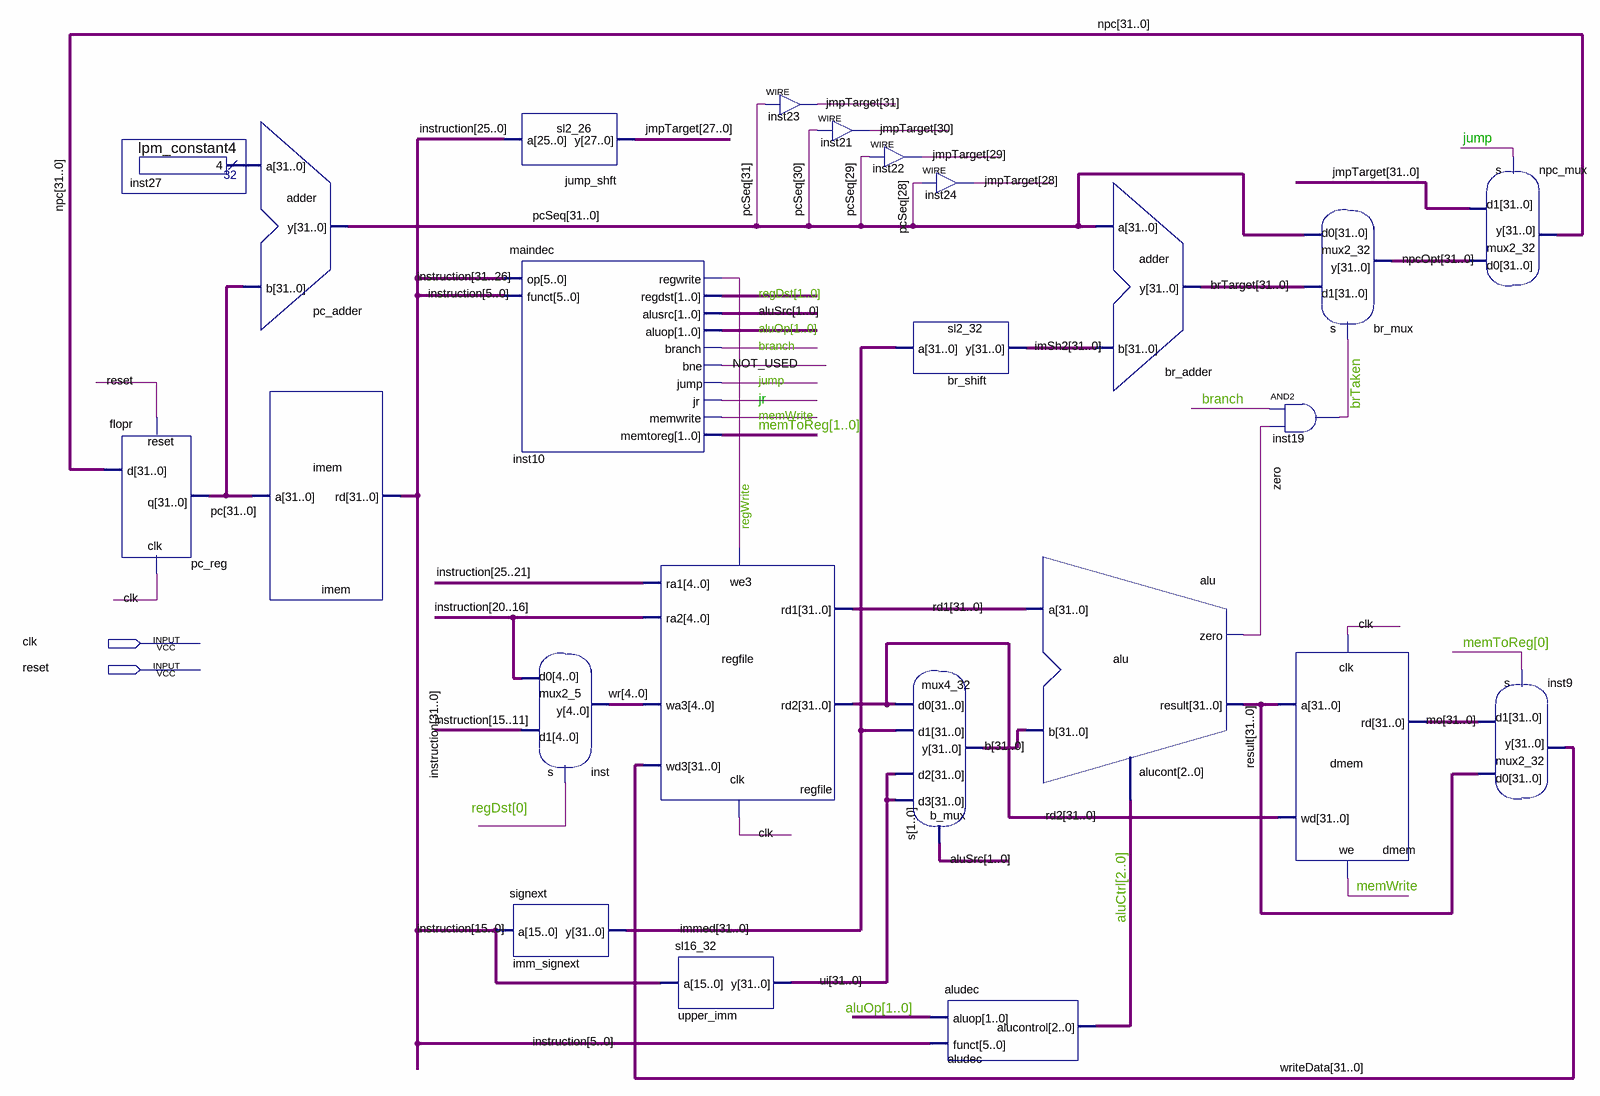
[diagram p0: schematic sheet]
// Quartus schematic mips.bdf as structural Verilog: 24 symbols, 2 pins
module mips (
  input  clk,
  input  reset
);

  wire branch, brTaken, jr, jump, memWrite, NOT_USED, regWrite, zero;
  wire [1:0] aluOp, aluSrc, memToReg, regDst;
  wire [2:0] aluCtrl;
  wire [4:0] wr;
  wire [31:0] b, brTarget, immed, imSh2, inst27_result, instruction, jmpTarget, mo, npc, npcOpt, pc, pcSeq,
       rd1, rd2, result, ui, writeData;

  lpm_constant4 inst27 (.result(inst27_result));
  flopr pc_reg (.clk(clk), .reset(reset), .d(npc), .q(pc));
  adder pc_adder (.a(inst27_result), .b(pc), .y(pcSeq));
  imem imem (.a(pc), .rd(instruction));
  sl2_26 jump_shft (.a(instruction[25:0]), .y(jmpTarget[27:0]));
  maindec inst10 (
    .op(instruction[31:26]), .funct(instruction[5:0]), .regwrite(regWrite), .regdst(regDst), .alusrc(aluSrc),
    .aluop(aluOp), .branch(branch), .bne(NOT_USED), .jump(jump), .jr(jr), .memwrite(memWrite),
    .memtoreg(memToReg));
  signext imm_signext (.a(instruction[15:0]), .y(immed));
  mux2_5 inst (.d0(instruction[20:16]), .d1(instruction[15:11]), .s(regDst[0]), .y(wr));
  regfile regfile (
    .clk(clk), .we3(regWrite), .ra1(instruction[25:21]), .ra2(instruction[20:16]), .wa3(wr), .wd3(writeData),
    .rd1(rd1), .rd2(rd2));
  sl16_32 upper_imm (.a(instruction[15:0]), .y(ui));
  assign jmpTarget[31] = pcSeq[31];  // WIRE inst23
  assign jmpTarget[30] = pcSeq[30];  // WIRE inst21
  assign jmpTarget[29] = pcSeq[29];  // WIRE inst22
  assign jmpTarget[28] = pcSeq[28];  // WIRE inst24
  sl2_32 br_shift (.a(immed), .y(imSh2));
  mux4_32 b_mux (.d0(rd2), .d1(immed), .d2(ui), .d3(ui), .s(aluSrc), .y(b));
  aludec aludec (.funct(instruction[5:0]), .aluop(aluOp), .alucontrol(aluCtrl));
  alu alu (.a(rd1), .b(b), .alucont(aluCtrl), .result(result), .zero(zero));
  adder br_adder (.a(pcSeq), .b(imSh2), .y(brTarget));
  and inst19 (brTaken, branch, zero);
  dmem dmem (.clk(clk), .we(memWrite), .a(result), .wd(rd2), .rd(mo));
  mux2_32 br_mux (.d0(pcSeq), .d1(brTarget), .s(brTaken), .y(npcOpt));
  mux2_32 npc_mux (.d0(npcOpt), .d1(jmpTarget), .s(jump), .y(npc));
  mux2_32 inst9 (.d0(result), .d1(mo), .s(memToReg[0]), .y(writeData));
endmodule
